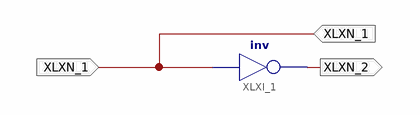
[diagram p0: schematic sheet 1]
// Xilinx ISE schematic CLK_SW.sch (spartan6) as structural Verilog: 1 symbols, 2 ports
module CLK_SW (
  input  XLXN_1,
  output XLXN_2
);

  not XLXI_1 (XLXN_2, XLXN_1);
endmodule
